# EAGLE design stm32f4stampV1_3_1 (EAGLE 9.6.1)
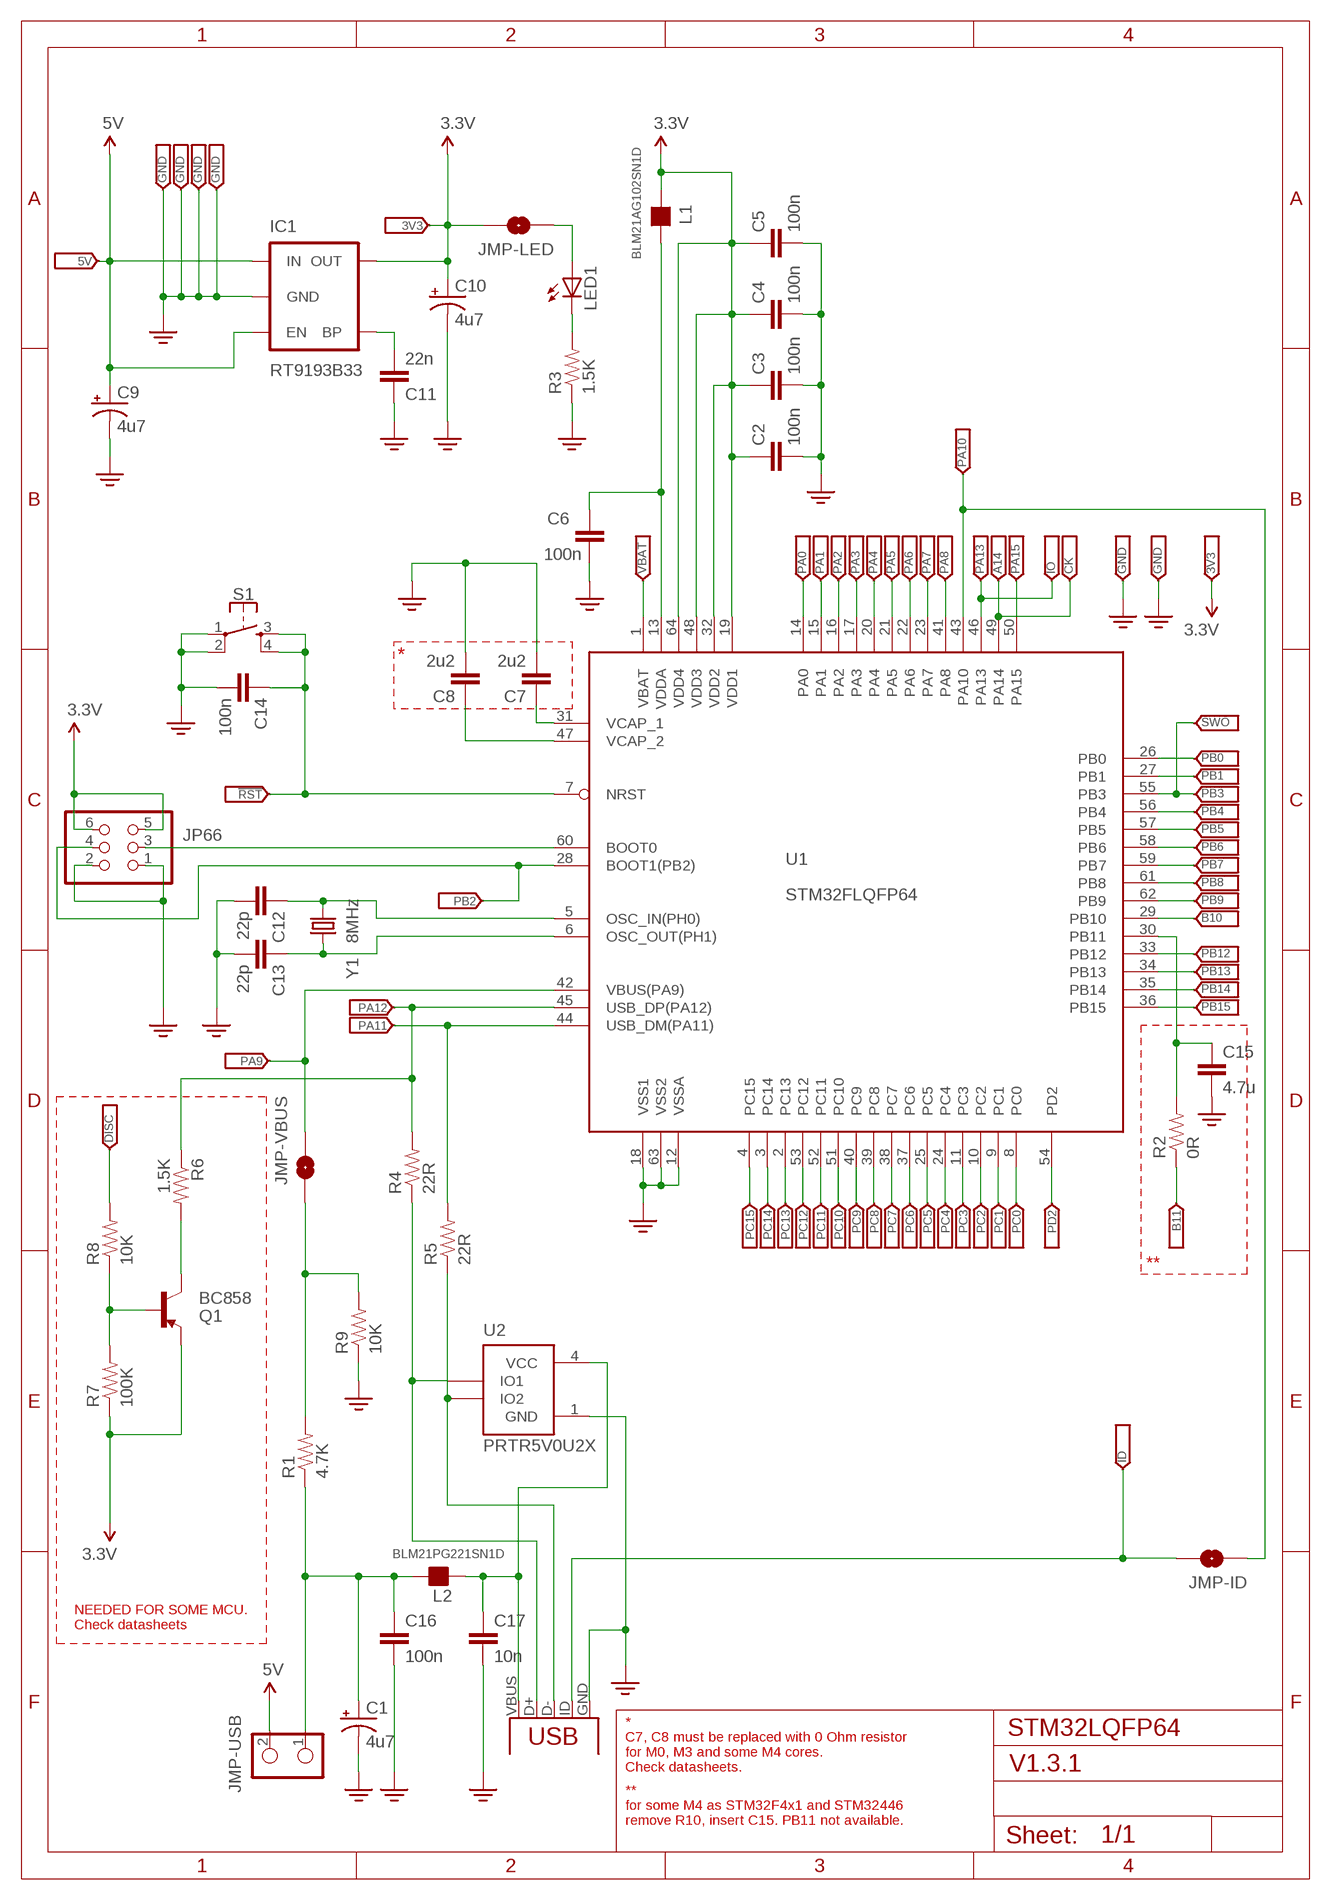
[diagram p0: schematic, sheet 1]

## Parts
C1  4u7  CAP_POL1206-KIT  [EIA3216-KIT]
C2  100n  CAP0805  [0805]
C3  100n  CAP0805  [0805]
C4  100n  CAP0805  [0805]
C5  100n  CAP0805  [0805]
C6  100n  CAP0805  [0805]
C7  2u2  CAP0805  [0805]
C8  2u2  CAP0805  [0805]
C9  4u7  CAP_POL1206-KIT  [EIA3216-KIT]
C10  4u7  CAP_POL1206-KIT  [EIA3216-KIT]
C11  22n  CAP0805  [0805]
C12  22p  CAP0805  [0805]
C13  22p  CAP0805  [0805]
C14  100n  CAP0805  [0805]
C15  4.7u  CAP0805  [0805]
C16  100n  CAP0805  [0805]
C17  10n  CAP0805  [0805]
IC1  RT9193B33  V_REG_LDOSMD  [SOT23-5]
JMP-ID  SOLDERJUMPERNO  [SJ_2S-NO]
JMP-LED  SOLDERJUMPERNO  [SJ_2S-NO]
JMP-USB  JUMPER-2PTH  [1X02]
JMP-VBUS  SOLDERJUMPERNO  [SJ_2S-NO]
JP1  PA12  HEADERHOLE-HEADERHOLE  [1X1-HEADER-HOLE]
JP2  5V  HEADERHOLE-HEADERHOLE  [1X1-HEADER-HOLE]
JP3  GND  HEADERHOLE-HEADERHOLE  [1X1-HEADER-HOLE]
JP4  3V3  HEADERHOLE-HEADERHOLE  [1X1-HEADER-HOLE]
JP5  DISC  HEADERHOLE-HEADERHOLE  [1X1-HEADER-HOLE]
JP6  GND  HEADERHOLE-HEADERHOLE  [1X1-HEADER-HOLE]
JP7  GND  HEADERHOLE-HEADERHOLE  [1X1-HEADER-HOLE]
JP8  PB8  HEADERHOLE-HEADERHOLE  [1X1-HEADER-HOLE]
JP9  PA10  HEADERHOLE-HEADERHOLE  [1X1-HEADER-HOLE]
JP10  PA8  HEADERHOLE-HEADERHOLE  [1X1-HEADER-HOLE]
JP11  PA13  HEADERHOLE-HEADERHOLE  [1X1-HEADER-HOLE]
JP12  PC9  HEADERHOLE-HEADERHOLE  [1X1-HEADER-HOLE]
JP13  PC15  HEADERHOLE-HEADERHOLE  [1X1-HEADER-HOLE]
JP14  PC14  HEADERHOLE-HEADERHOLE  [1X1-HEADER-HOLE]
JP15  PC13  HEADERHOLE-HEADERHOLE  [1X1-HEADER-HOLE]
JP16  PC12  HEADERHOLE-HEADERHOLE  [1X1-HEADER-HOLE]
JP17  PC11  HEADERHOLE-HEADERHOLE  [1X1-HEADER-HOLE]
JP18  PC10  HEADERHOLE-HEADERHOLE  [1X1-HEADER-HOLE]
JP19  PC8  HEADERHOLE-HEADERHOLE  [1X1-HEADER-HOLE]
JP20  PC7  HEADERHOLE-HEADERHOLE  [1X1-HEADER-HOLE]
JP21  PC6  HEADERHOLE-HEADERHOLE  [1X1-HEADER-HOLE]
JP22  PC5  HEADERHOLE-HEADERHOLE  [1X1-HEADER-HOLE]
JP23  PC4  HEADERHOLE-HEADERHOLE  [1X1-HEADER-HOLE]
JP24  PC3  HEADERHOLE-HEADERHOLE  [1X1-HEADER-HOLE]
JP25  PC2  HEADERHOLE-HEADERHOLE  [1X1-HEADER-HOLE]
JP26  PC1  HEADERHOLE-HEADERHOLE  [1X1-HEADER-HOLE]
JP27  PC0  HEADERHOLE-HEADERHOLE  [1X1-HEADER-HOLE]
JP28  PD2  HEADERHOLE-HEADERHOLE  [1X1-HEADER-HOLE]
JP29  PA0  HEADERHOLE-HEADERHOLE  [1X1-HEADER-HOLE]
JP30  PA1  HEADERHOLE-HEADERHOLE  [1X1-HEADER-HOLE]
JP31  PA2  HEADERHOLE-HEADERHOLE  [1X1-HEADER-HOLE]
JP32  PA3  HEADERHOLE-HEADERHOLE  [1X1-HEADER-HOLE]
JP33  PA4  HEADERHOLE-HEADERHOLE  [1X1-HEADER-HOLE]
JP34  PA5  HEADERHOLE-HEADERHOLE  [1X1-HEADER-HOLE]
JP35  PA6  HEADERHOLE-HEADERHOLE  [1X1-HEADER-HOLE]
JP36  PA7  HEADERHOLE-HEADERHOLE  [1X1-HEADER-HOLE]
JP37  A14  HEADERHOLE-HEADERHOLE  [1X1-HEADER-HOLE]
JP38  PA15  HEADERHOLE-HEADERHOLE  [1X1-HEADER-HOLE]
JP39  PB0  HEADERHOLE-HEADERHOLE  [1X1-HEADER-HOLE]
JP40  PB1  HEADERHOLE-HEADERHOLE  [1X1-HEADER-HOLE]
JP41  PB3  HEADERHOLE-HEADERHOLE  [1X1-HEADER-HOLE]
JP42  PB4  HEADERHOLE-HEADERHOLE  [1X1-HEADER-HOLE]
JP43  PB5  HEADERHOLE-HEADERHOLE  [1X1-HEADER-HOLE]
JP44  PB6  HEADERHOLE-HEADERHOLE  [1X1-HEADER-HOLE]
JP45  PB7  HEADERHOLE-HEADERHOLE  [1X1-HEADER-HOLE]
JP46  PB9  HEADERHOLE-HEADERHOLE  [1X1-HEADER-HOLE]
JP47  B10  HEADERHOLE-HEADERHOLE  [1X1-HEADER-HOLE]
JP48  B11  HEADERHOLE-HEADERHOLE  [1X1-HEADER-HOLE]
JP49  PB12  HEADERHOLE-HEADERHOLE  [1X1-HEADER-HOLE]
JP50  PB13  HEADERHOLE-HEADERHOLE  [1X1-HEADER-HOLE]
JP51  PB14  HEADERHOLE-HEADERHOLE  [1X1-HEADER-HOLE]
JP52  PB15  HEADERHOLE-HEADERHOLE  [1X1-HEADER-HOLE]
JP53  VBAT  HEADERHOLE-HEADERHOLE  [1X1-HEADER-HOLE]
JP54  !RST  HEADERHOLE-HEADERHOLE  [1X1-HEADER-HOLE]
JP55  GND  HEADERHOLE-HEADERHOLE  [1X1-HEADER-HOLE]
JP56  ID  HEADERHOLE-HEADERHOLE  [1X1-HEADER-HOLE]
JP57  PB2  HEADERHOLE-HEADERHOLE  [1X1-HEADER-HOLE]
JP58  PA11  HEADERHOLE-HEADERHOLE  [1X1-HEADER-HOLE]
JP59  IO  HEADERHOLE-HEADERHOLE  [1X1-HEADER-HOLE]
JP60  CK  HEADERHOLE-HEADERHOLE  [1X1-HEADER-HOLE]
JP61  SWO  HEADERHOLE-HEADERHOLE  [1X1-HEADER-HOLE]
JP62  GND  HEADERHOLE-HEADERHOLE  [1X1-HEADER-HOLE]
JP63  3V3  HEADERHOLE-HEADERHOLE  [1X1-HEADER-HOLE]
JP64  PA9  HEADERHOLE-HEADERHOLE  [1X1-HEADER-HOLE]
JP65  GND  HEADERHOLE-HEADERHOLE  [1X1-HEADER-HOLE]
JP66  PINHD-2X3  [2X03]
L1  BLM21AG102SN1D  FB_0805  [L0805]
L2  BLM21PG221SN1D  FB_0805  [L0805]
LED1  LEDSML0805  [SML0805]
Q1  BC858  TRANSISTOR_PNPSMD  [SOT23-3]
R1  4.7K  RESISTOR0805-RES  [0805]
R2  0R  RESISTOR0805-RES  [0805]
R3  1.5K  RESISTOR0805-RES  [0805]
R4  22R  RESISTOR0805-RES  [0805]
R5  22R  RESISTOR0805-RES  [0805]
R6  1.5K  RESISTOR0805-RES  [0805]
R7  100K  RESISTOR0805-RES  [0805]
R8  10K  RESISTOR0805-RES  [0805]
R9  10K  RESISTOR0805-RES  [0805]
S1  MOMENTARY-SWITCH-SPST-2-SMD-5.2MM  [TACTILE_SWITCH_SMD_5.2MM]
U1  STM32FLQFP64  STM32F405RGT  [LQFP64]
U2  PRTR5V0U2X  [SOT-143B]
USB  USB-MICROB-SMD  [USB-MICROB-SMD]
Y1  8MHz  CRYSTAL5X3  [CRYSTAL-SMD-5X3]

## Nets
3.3V: C2.1 C3.1 C4.1 C5.1 C10.A(+) IC1.5(OUT) JMP-LED.2 JP4.1 JP63.1 JP66.5 JP66.6 L1.2 Q1.2(E) R7.1 U1.19(VDD1) U1.32(VDD2) U1.48(VDD3) U1.64(VDD4)
5V: C9.A(+) IC1.1(IN) IC1.3(EN) JMP-USB.2 JP2.1
GND: C1.C(-) C2.2 C3.2 C4.2 C5.2 C6.2 C7.2 C8.2 C9.C(-) C10.C(-) C11.1 C12.2 C13.2 C14.2 C15.2 C16.2 C17.2 IC1.2(GND) JP3.1 JP6.1 JP7.1 JP55.1 JP62.1 JP65.1 JP66.1 JP66.2 R3.1 R9.1 S1.1 S1.2 U1.12(VSSA) U1.18(VSS1) U1.63(VSS2) U2.1(GND) USB.GND USB.MT1 USB.MT2 USB.MT3 USB.MT4
N$1: JP1.1 R4.2 R6.1 U1.45(USB_DP(PA12))
N$2: JP13.1 U1.4(PC15)
N$3: C1.A(+) C16.1 JMP-USB.1 L2.2 R1.1
N$4: JP12.1 U1.40(PC9)
N$5: C17.1 L2.1 U2.4(VCC) USB.VBUS
N$6: JP58.1 R5.2 U1.44(USB_DM(PA11))
N$7: JP8.1 U1.61(PB8)
N$8: C11.2 IC1.4(BP)
N$9: JP66.3 U1.60(BOOT0)
N$10: JP10.1 U1.41(PA8)
N$11: JP11.1 JP59.1 U1.46(PA13)
N$12: C13.1 U1.6(OSC_OUT(PH1)) Y1.1
N$13: C7.1 U1.31(VCAP_1)
N$14: C8.1 U1.47(VCAP_2)
N$15: C12.1 U1.5(OSC_IN(PH0)) Y1.3
N$16: JP57.1 JP66.4 U1.28(BOOT1(PB2))
N$17: C14.1 JP54.1 S1.3 S1.4 U1.7(NRST)
N$18: LED1.C R3.2
N$19: C6.1 L1.1 U1.13(VDDA)
N$20: JMP-ID.2 JP56.1 USB.ID
N$21: R5.1 U2.3(IO2) USB.D-
N$22: JMP-ID.1 JP9.1 U1.43(PA10)
N$23: JP14.1 U1.3(PC14)
N$24: JMP-VBUS.1 R1.2 R9.2
N$25: JP15.1 U1.2(PC13)
N$26: JP16.1 U1.53(PC12)
N$27: JP17.1 U1.52(PC11)
N$28: JP18.1 U1.51(PC10)
N$29: JP19.1 U1.39(PC8)
N$30: JP20.1 U1.38(PC7)
N$31: JP21.1 U1.37(PC6)
N$32: JP22.1 U1.25(PC5)
N$33: JP23.1 U1.24(PC4)
N$34: JP24.1 U1.11(PC3)
N$35: JP25.1 U1.10(PC2)
N$36: JP26.1 U1.9(PC1)
N$37: JP27.1 U1.8(PC0)
N$38: JP28.1 U1.54(PD2)
N$39: JP29.1 U1.14(PA0)
N$40: JP30.1 U1.15(PA1)
N$41: JP31.1 U1.16(PA2)
N$42: JP32.1 U1.17(PA3)
N$43: JP33.1 U1.20(PA4)
N$44: JP34.1 U1.21(PA5)
N$45: JP35.1 U1.22(PA6)
N$46: JP36.1 U1.23(PA7)
N$47: JP37.1 JP60.1 U1.49(PA14)
N$48: JP38.1 U1.50(PA15)
N$49: JP39.1 U1.26(PB0)
N$50: JP40.1 U1.27(PB1)
N$51: JP41.1 JP61.1 U1.55(PB3)
N$52: JP42.1 U1.56(PB4)
N$53: JP43.1 U1.57(PB5)
N$54: JP44.1 U1.58(PB6)
N$55: JP45.1 U1.59(PB7)
N$56: JP46.1 U1.62(PB9)
N$57: JP47.1 U1.29(PB10)
N$58: C15.1 R2.2 U1.30(PB11)
N$59: JP49.1 U1.33(PB12)
N$60: JP50.1 U1.34(PB13)
N$61: JP51.1 U1.35(PB14)
N$62: JP52.1 U1.36(PB15)
N$63: JP53.1 U1.1(VBAT)
N$65: R4.1 U2.2(IO1) USB.D+
N$66: JMP-LED.1 LED1.A
N$67: JMP-VBUS.2 JP64.1 U1.42(VBUS(PA9))
N$68: Q1.3(C) R6.2
N$70: JP48.1 R2.1
N$71: Q1.1(B) R7.2 R8.1
N$72: JP5.1 R8.2

## Notes on the sheet
- *
- **
- NEEDED FOR SOME MCU. 
  Check datasheets
- STM32LQFP64
- *
  C7, C8 must be replaced with 0 Ohm resistor 
  for M0, M3 and some M4 cores. 
  Check datasheets.
- V1.3.1
- **
  for some M4 as STM32F4x1 and STM32446
  remove R10, insert C15. PB11 not available.

## Library data of the parts
C1 C9 C10 = stm32f4stamp:CAP_POL: Capacitor Polarized These are standard SMD and PTH capacitors. Normally 10uF, 47uF, and 100uF in electrolytic and tantalum varieties. Always verify the external diameter of the through hole cap, it varies with capacity, voltage, and manufacturer. The EIA devices should be standard.
C2-C8 C11-C17 = stm32f4stamp:CAP: Capacitor Standard 0603 ceramic capacitor, and 0.1" leaded capacitor.
IC1 = stm32f4stamp:V_REG_LDO: Voltage Regulator LDO Standard 150mA LDO voltage regulator in SOT-23 layout. Micrel part MIC5205. BP (by-pass) pin is used to lower output noise with 470pF cap.
JMP-ID JMP-LED JMP-VBUS = stm32f4stamp:SOLDERJUMPER: Solder Jumper Standard SMD solder jumper. Used to automate production. Two varients : Normally Open and Normally Closed are the same, but have different paste layers. NC will have a large amount of paste and should jumper during reflow.
JMP-USB = stm32f4stamp:JUMPER-2: Jumper Basic 0.1" spaced jumper. Use with breakaway headers.
JP1-JP65 = stm32f4stamp:HEADERHOLE
JP66 = pinhead:PINHD-2X3: PIN HEADER
L1 L2 = rc-master:FB_: FERRITE BEAD
LED1 = led:LED: LED OSRAM: - CHIPLED LG R971, LG N971, LY N971, LG Q971, LY Q971, LO R971, LY R971 LH N974, LH R974 LS Q976, LO Q976, LY Q976 LO Q996 - Hyper CHIPLED LW Q18S LB Q993, LB Q99A, LB R99A - SideLED LS A670, LO A670, LY A670, LG A670, LP A670 LB A673, LV A673, LT A673, LW A673 LH A674 LY A675 LS A676, LA A676, LO A676, LY A676, LW A676 LS A679, LY A679, LG A679 - Hyper Micro SIDELED® LS Y876, LA Y876, LO Y876, LY Y876 LT Y87S - SmartLED LW L88C, LW L88S LB L89C, LB L89S, LG L890 LS L89K, LO L89K, LY L89K LS L896, LA L896, LO L896, LY L896 - TOPLED LS T670, LO T670, LY T670, LG T670, LP T670 LSG T670, LSP T670, LSY T670, LOP T670, LYG T670 LG T671, LOG T671, LSG T671 LB T673, LV T673, LT T673, LW T673 LH T674 LS T676, LA T676, LO T676, LY T676, LB T676, LH T676, LSB T676, LW T676 LB T67C, LV T67C, LT T67C, LS T67K, LO T67K, LY T67K, LW E67C LS E67B, LA E67B, LO E67B, LY E67B, LB E67C, LV E67C, LT E67C LW T67C LS T679, LY T679, LG T679 LS T770, LO T770, LY T770, LG T770, LP T770 LB T773, LV T773, LT T773, LW T773 LH T774 LS E675, LA E675, LY E675, LS T675 LS T776, LA T776, LO T776, LY T776, LB T776 LHGB T686 LT T68C, LB T68C - Hyper Mini TOPLED® LB M676 - Mini TOPLED Santana® LG M470 LS M47K, LO M47K, LY M47K Source: http://www.osram.convergy.de LUXEON: - LUMILED® LXK2-PW12-R00, LXK2-PW12-S00, LXK2-PW14-U00, LXK2-PW14-V00 LXK2-PM12-R00, LXK2-PM12-S00, LXK2-PM14-U00 LXK2-PE12-Q00, LXK2-PE12-R00, LXK2-PE12-S00, LXK2-PE14-T00, LXK2-PE14-U00 LXK2-PB12-K00, LXK2-PB12-L00, LXK2-PB12-M00, LXK2-PB14-N00, LXK2-PB14-P00, LXK2-PB14-Q00 LXK2-PR12-L00, LXK2-PR12-M00, LXK2-PR14-Q00, LXK2-PR14-R00 LXK2-PD12-Q00, LXK2-PD12-R00, LXK2-PD12-S00 LXK2-PH12-R00, LXK2-PH12-S00 LXK2-PL12-P00, LXK2-PL12-Q00, LXK2-PL12-R00 Source: www.luxeon.com KINGBRIGHT: KA-3528ASYC Source: www.kingbright.com
Q1 = SparkFun:TRANSISTOR_PNP
R1-R9 = stm32f4stamp:RESISTOR: Resistor Basic schematic elements and footprints for 0603, 1206, and PTH resistors.
S1 = SparkFun-Switches:MOMENTARY-SWITCH-SPST-2: Momentary Switch (Pushbutton) - SPST - Two Circuits Normally-open (NO) SPST momentary switches (buttons, pushbuttons). Schematic symbol includes two switch circuits. Variants SMD-4.6MMX2.8MM - 4.60mm x 2.80mm Tactile Momentary Button Switch - Used on SparkFun SAMD21 Mini Breakout <https://www.sparkfun.com/products/13664> SMD-5.2MM - Mini Pushbutton Switch - SMD <https://www.sparkfun.com/products/8720> - Used on Arduino Pro Mini <https://www.sparkfun.com/products/11114>; PROD_ID: SWCH-08247; SF_SKU: COM-08720
U1 = stm32f4stamp:STM32F405RGT
U2 = Volks73-NXPSemiconductors:PRTR5V0U2X?: I2C-Bus EDS Protection Ulta low capacitance double rail-to-rail ESD protection diode Documentation Datasheet <http://www.nxp.com/documents/data_sheet/PRTR5V0U2X.pdf> General Description Ultra low capacitance rail-to-rail ElectroStatic Discharge (ESD) protection diode in a small SOT143B Surface-Mounted Device (SMD) plastic package designed to protect two Hi-Speed data lines or high-frequency signal lines from the damage caused by ESD and other transients. PRTR5V0U2X incorporates two pairs of ultra low capacitance rail-to-rail diodes as well as an additional ESD protection diode to ensure signal line protection even if no supply voltage is available. Features ESD protection of two Hi-Speed data lines or high-frequency signal lines Ultra low input/output to ground capacitance: C(I/O-GND) = 1 pF ESD protection up to 8kV IEC 61000-4-2, level 4 (ESD) Very low clamping voltage due to an integrated additional ESD protection diode Very low reverse current Small SMD plastic package Applications USB 2.0 ports Digital Video Interface (DVI)/High Definition Multimedia Interface (HDMI) interfaces Mobile and cordless phones Personal Digital Assistants (PDA) Digital Cameras Wide Area Network (WAN) / Local Area Network (LAN) systems PCs, notebooks, printers, and other PC peripherals; APPLICATIONS: General Purpose; BIDIRECTIONAL_CHANNELS: 2; CAPACITANCE: 1pF @ 1MHz; CURRENT_PEAK_PULSE: -; DESCRIPTION: TVS DIODE 5.5VWM SOT143B; DOCUMENTATION_LINK: <a href="http://www.nxp.com/documents/data_sheet/PRTR5V0U2X.pdf">Datasheet</a>; DOCUMENTATION_URL: http://www.nxp.com/documents/data_sheet/PRTR5V0U2X.pdf; MANUFACTURER: NXP Semiconductors; MOUNTING_TYPE: Surface Mount; OPERATING_TEMPERATURE: -40C ~ 85C; PART_NUMBER: PRTR5V0U2X,215; POWER-PEAK_PULSE: -; POWER_LINE_PROTECTION: Yes; SUPPLIER_ITEM_LINK: <a href="http://www.digikey.com/product-detail/en/PRTR5V0U2X,215/568-4140-1-ND/1589981">Details</a>; SUPPLIER_ITEM_NUMBER: 568-4140-1-ND; SUPPLIER_ITEM_URL: http://www.digikey.com/product-detail/en/PRTR5V0U2X,215/568-4140-1-ND/1589981; SUPPLIER_LINK: <a href="http://www.digikey.com">Home Page</a>; SUPPLIER_NAME: Digi-Key; SUPPLIER_URL: http://www.digikey.com; TYPE: Steering (Rail to Rail); UNIDIRECTIONAL_CHANNELS: -; VOLTAGE_BREAKDOWN: 6V; VOLTAGE_CLAMPING: -; VOLTAGE_REVERSE: 5.5V
USB = stm32f4stamp:USB: USB Connectors USB-B-PTH is fully proven SKU : PRT-00139 USB-miniB is fully proven SKU : PRT-00587 USB-A-PCB is untested. USB-A-H is throughly reviewed, but untested. Spark Fun Electronics SKU : PRT-00437 USB-B-SMT is throughly reviewed, but untested. Needs silkscreen touching up. USB-A-S has not been used/tested USB-MB-H has not been used/tested
Y1 = stm32f4stamp:CRYSTAL: Crystals Various standard crystals. Proven footprints. Spark Fun Electronics SKU : COM-00534

## Board
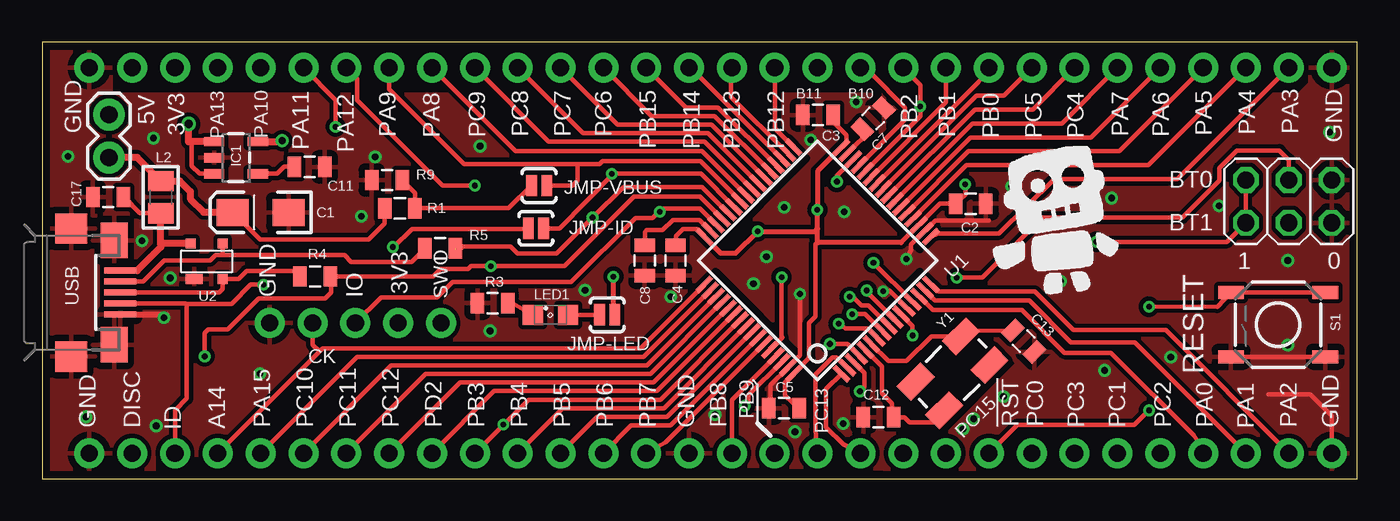
[diagram p1: board, top side]
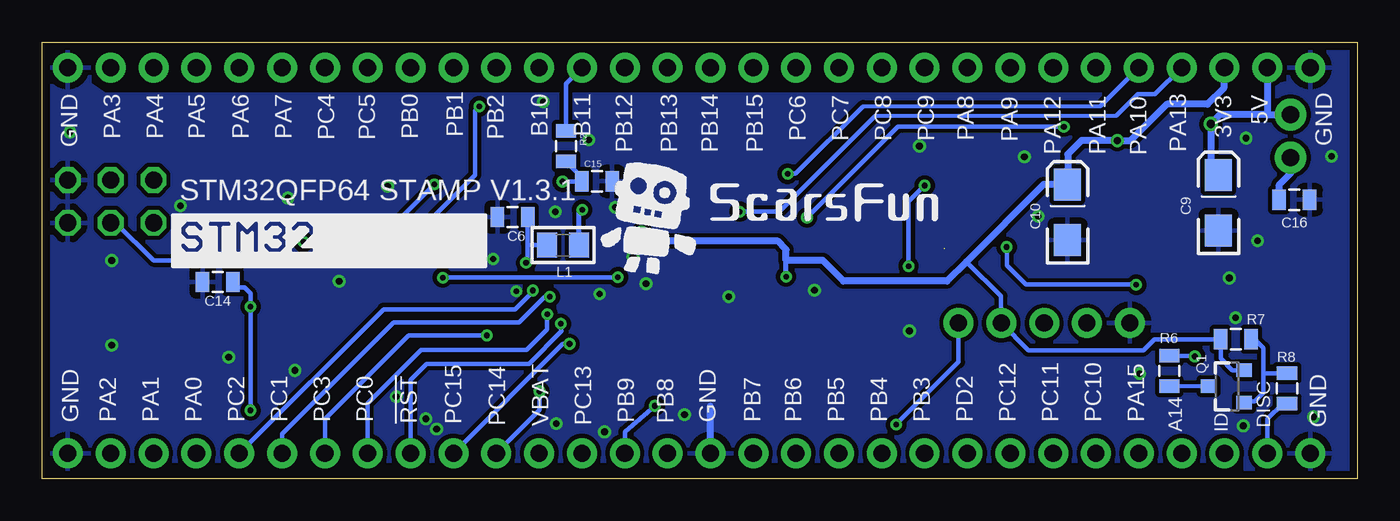
[diagram p2: board, bottom side, seen from below]

Size 77.98 x 25.91 mm. Coordinates in mm from the lower left corner, seen from the top.
Outline: 0,0 77.98,0 77.98,25.91 0,25.91 0,0
Copper layers (1*16): Top 0.0356mm / dielectric 1.9011mm / Bottom 0.0356mm
Design rules "default *": minimum track width 6mil, minimum drill 13mil, track to track 10mil, track to pad 15mil, pad to pad 6mil, via to via 6mil, smd to smd 6mil, copper to edge 18mil, drill to drill 6mil, minimum pad ring 7mil, minimum via ring 7mil, stop-mask expansion 2mil, vias tented up to drill 25mil, thermal gap 15mil
tRestrict: 2 lines

### Footprints (pad centres in the part's own frame; a part is rotated, then mirrored left to right if it is on the bottom)
EIA3216-KIT = smd 1.9 x 1.6: A 1.65,0; C -1.65,0
0805 = smd 0.8 x 1.2: 1 -0.9,0; 2 0.9,0
SOT23-5 = smd 0.55 x 1.2: 1 -0.95,-1.3; 2 0,-1.3; 3 0.95,-1.3; 4 0.95,1.3; 5 -0.95,1.3
SJ_2S-NO = smd 0.635 x 1.27: 1 -0.45,0; 2 0.45,0
1X02 = drill 1.016 pad 1.88: 1 0,0; 2 2.54,0
1X1-HEADER-HOLE = drill 1.016 pad 1.778: 1 0,0
2X03 = drill 1.016 octagon: 1 -2.54,-1.27; 2 -2.54,1.27; 3 0,-1.27; 4 0,1.27; 5 2.54,-1.27; 6 2.54,1.27
L0805 = smd 1.2 x 1.5: 1 -0.953,0; 2 0.953,0
SML0805 = smd 1.2 x 1.2: A 1.05,0; C -1.05,0
SOT23-3 = smd 0.8 x 0.9: 1 -0.95,-1; 2 0.95,-1; 3 0,1.1
TACTILE_SWITCH_SMD_5.2MM = smd 1.524 x 0.762: 1 -2.794,1.905; 2 2.794,1.905; 3 -2.794,-1.905; 4 2.794,-1.905
LQFP64 = smd 0.3 x 1.2: 1 -3.75,-5.75; 2 -3.25,-5.75; 3 -2.75,-5.75; 4 -2.25,-5.75; 5 -1.75,-5.75; 6 -1.25,-5.75; 7 -0.75,-5.75; 8 -0.25,-5.75; 9 0.25,-5.75; 10 0.75,-5.75; 11 1.25,-5.75; 12 1.75,-5.75; 13 2.25,-5.75; 14 2.75,-5.75; 15 3.25,-5.75; 16 3.75,-5.75; 33 3.75,5.75; 34 3.25,5.75; 35 2.75,5.75; 36 2.25,5.75; 37 1.75,5.75; 38 1.25,5.75; 39 0.75,5.75; 40 0.25,5.75; 41 -0.25,5.75; 42 -0.75,5.75; 43 -1.25,5.75; 44 -1.75,5.75; 45 -2.25,5.75; 46 -2.75,5.75; 47 -3.25,5.75; 48 -3.75,5.75 | smd 1.2 x 0.3: 17 5.75,-3.75; 18 5.75,-3.25; 19 5.75,-2.75; 20 5.75,-2.25; 21 5.75,-1.75; 22 5.75,-1.25; 23 5.75,-0.75; 24 5.75,-0.25; 25 5.75,0.25; 26 5.75,0.75; 27 5.75,1.25; 28 5.75,1.75; 29 5.75,2.25; 30 5.75,2.75; 31 5.75,3.25; 32 5.75,3.75; 49 -5.75,3.75; 50 -5.75,3.25; 51 -5.75,2.75; 52 -5.75,2.25; 53 -5.75,1.75; 54 -5.75,1.25; 55 -5.75,0.75; 56 -5.75,0.25; 57 -5.75,-0.25; 58 -5.75,-0.75; 59 -5.75,-1.25; 60 -5.75,-1.75; 61 -5.75,-2.25; 62 -5.75,-2.75; 63 -5.75,-3.25; 64 -5.75,-3.75
SOT-143B = smd 1 x 0.6: 1 -0.75,-1.05 | smd 0.6 x 0.6: 2 0.95,-1.05; 3 0.95,1.05; 4 -0.95,1.05
USB-MICROB-SMD = smd 0.35 x 1.9: D+ 0,2.9; D- -0.65,2.9; GND 1.3,2.9; ID 0.65,2.9; VBUS -1.3,2.9 | smd 1.8 x 1.9: MT1 -3.8,0; MT2 3.8,0 | smd 2.1 x 1.6: MT3 -3.1,2.55; MT4 3.1,2.55
CRYSTAL-SMD-5X3 = smd 2 x 1.2: 1 -1.9,-1.2; 2 1.9,-1.2; 3 1.9,1.2; 4 -1.9,1.2

### Placement (x,y rotation side)
C1  12.95,15.81 180 top
C2  55.05,16.32 0 top
C3  46,21.59 180 top
C4  37.55,12.95 270 top
C5  43.98,4.19 180 top
C6  50.09,15.53 180 bottom
C7  49.26,21.37 45 top
C8  35.73,12.95 270 top
C9  8.23,16.37 90 bottom
C10  17.18,15.81 90 bottom
C11  15.86,18.5 180 top
C12  49.58,3.66 180 top
C13  58.19,8.17 315 top
C14  67.56,11.68 180 bottom
C15  45.08,17.65 0 bottom
C16  3.73,16.56 0 bottom
C17  3.91,16.71 180 top
IC1  11.49,19.05 270 top
JMP-ID  29.27,14.86 180 top
JMP-LED  33.5,9.73 0 top
JMP-USB  3.96,19.06 90 top
JMP-VBUS  29.46,17.4 0 top
JP1  18.03,24.38 0 top
JP2  5.33,24.38 0 top
JP3  2.79,24.38 0 top
JP4  7.87,24.38 0 top
JP5  5.33,1.52 0 top
JP6  76.45,1.52 0 top
JP7  76.45,24.38 0 top
JP8  40.89,1.52 0 top
JP9  12.95,24.38 0 top
JP10  23.11,24.38 90 top
JP11  10.41,24.38 0 top
JP12  25.65,24.38 0 top
JP13  53.59,1.52 0 top
JP14  51.05,1.52 0 top
JP15  45.97,1.52 0 top
JP16  20.57,1.52 0 top
JP17  18.03,1.52 0 top
JP18  15.49,1.52 0 top
JP19  28.19,24.38 0 top
JP20  30.73,24.38 0 top
JP21  33.27,24.38 0 top
JP22  58.67,24.38 0 top
JP23  61.21,24.38 0 top
JP24  61.21,1.52 0 top
JP25  66.29,1.52 0 top
JP26  63.75,1.52 0 top
JP27  58.67,1.52 0 top
JP28  23.11,1.52 0 top
JP29  68.83,1.52 0 top
JP30  71.37,1.52 0 top
JP31  73.91,1.52 0 top
JP32  73.91,24.38 0 top
JP33  71.37,24.38 0 top
JP34  68.83,24.38 0 top
JP35  66.29,24.38 0 top
JP36  63.75,24.38 0 top
JP37  10.41,1.52 0 top
JP38  12.95,1.52 0 top
JP39  56.13,24.38 0 top
JP40  53.59,24.38 0 top
JP41  25.65,1.52 0 top
JP42  28.19,1.52 0 top
JP43  30.73,1.52 0 top
JP44  33.27,1.52 0 top
JP45  35.81,1.52 0 top
JP46  43.43,1.52 270 top
JP47  48.51,24.38 270 top
JP48  45.97,24.38 270 top
JP49  43.43,24.38 270 top
JP50  40.89,24.38 270 top
JP51  38.35,24.38 270 top
JP52  35.81,24.38 270 top
JP53  48.51,1.52 0 top
JP54  56.13,1.52 0 top
JP55  38.35,1.52 0 top
JP56  7.87,1.52 0 top
JP57  51.05,24.38 0 top
JP58  15.49,24.38 0 top
JP59  18.57,9.25 0 top
JP60  16.03,9.25 0 top
JP61  23.65,9.25 0 top
JP62  13.49,9.25 0 top
JP63  21.11,9.25 0 top
JP64  20.57,24.38 0 top
JP65  2.79,1.52 0 top
JP66  73.91,16.46 180 top
L1  47.09,13.87 0 bottom
L2  7.04,16.71 90 top
LED1  30.14,9.73 0 top
Q1  7.72,5.49 90 bottom
R1  21.21,16.05 0 top
R2  46.91,19.74 270 bottom
R3  26.71,10.43 0 top
R4  16.19,12 0 top
R5  23.6,13.68 0 top
R6  11.15,6.4 270 bottom
R7  7.21,8.28 0 bottom
R8  4.17,5.36 270 bottom
R9  20.45,17.73 0 top
S1  73.28,9.14 180 top
U1  45.97,12.95 45 top
U2  9.75,12.9 0 top
USB  1.71,11.05 270 top
Y1  53.98,6.26 225 top

### Tracks (layer width: path | path; a pad name or v marks a point on that pad's centre or on a via)
3.3V  (via drill 0.33, 0.4)
  Top 0.152: JMP-LED.2 33.95,9.7 33.87,9.61
  Top 0.254: v54.74,17.46 54.74,16.85 C2.1 53.23,16.32 U1.19 52.01,15.1 | C5.1 44.03,4.96 44.03,5.71 U1.64 45.47,7.17 45.47,9.25 45.85,9.63 45.85,13.94 45.97,14.07 | U1.32 47.69,19.97 47.69,20.38 46.86,21.21 C3.1 | U1.48 38.81,14.83 38,14.83 37.57,14.4 37.57,13.87 C4.1 | v62.5,14.06 70.25,14.06 JP66.6 JP66.5
  Top 0.279: 50.92,14.01 50.95,14.04 52.01,15.1
  Top 0.305: U1.32 45.97,18.26 45.97,15.98 v45.96,15.96 45.97,15.95 45.97,14.84 | 33.87,9.61 v33.87,12 | 45.97,14.84 45.97,14.07 46.02,14.01 50.92,14.01 | U1.48 39.3,14.32 40.23,13.39 41.12,13.39 v42.42,14.68 45.82,14.68 45.97,14.84
  Top 0.406: IC1.5 14.16,20 v14.22,20.07
  Bottom 0.254: v54.74,17.46 58.14,14.06 v62.5,14.06 | L1.2 46.15,13.88 | Q1.2 7.4,6.44 8.1,7.14 8.1,8.27 R7.1 12.04,8.28 12.7,7.62 19.51,7.62 JP63.1 21.13,10.85 23.19,12.88
  Bottom 0.305: v33.87,12 33.87,12.95 | v45.96,15.96 46.15,15.77 46.15,13.88
  Bottom 0.406: 14.26,20.1 v14.22,20.07 | JP4.1 7.9,24.36 7.9,23.22 8.89,22.23 11.3,22.23 13.49,20.04 14.2,20.04 v14.22,20.07 | v42.42,14.68 41.86,14.1 34.34,14.1 33.87,13.6 33.87,12.95 31.69,12.95 30.48,11.73 24.33,11.73 23.19,12.88 18.61,17.46 C10.A 17.17,17.47 17.17,19.25 16.36,20.07 v14.22,20.07
5V  (via drill 0.5)
  Top 0.203: 8.72,20 8.69,20
  Top 0.254: IC1.3 9.33,18.1 8.87,18.57 8.87,19.85 8.72,20
  Top 0.406: IC1.1 8.72,20 | 8.69,20 v8.69,21.06
  Bottom 0.305: 8.69,18.5 C9.A
  Bottom 0.406: 8.69,18.5 v8.69,21.06 8.14,21.6 5.31,21.6 | 5.31,21.6 JMP-USB.2 | JP2.1 5.33,21.63 5.31,21.6
GND  (via drill 0.33, 0.35, 0.4)
  Top 0.254: U1.12 50.23,11.18 v49.87,11.12 | 56.14,15.33 52.95,15.33 U1.18 52.31,14.7 51.51,13.89 51.51,13.54 v51.24,13.04 | 72.71,5.02 75.18,5.02 76.45,3.75 JP6.1 | S1.1 S1.2 | C5.2 43.19,4.3 43.19,5.57 U1.63 44.93,7.32 v44.93,10.97
  Top 0.305: 7.37,9.75 7.37,9.59
  Top 0.356: USB.GND 7.37,9.75
  Bottom 0.406: JP55.1 38.35,4.32
  other vias: 43.99,16.1 73.85,12.95 25.97,19.74 19.74,19.1 18.92,15.57 47.5,3.28 57.49,17.35 62.99,6.44 69.79,16.19 45.57,20.1 48.26,22.36 56.98,4.88 60.38,11.72 63.41,16.66 73.85,7.94 44.64,2.79 37.27,10.81 42.18,11.57 12.91,6.24 42.95,13.18 76.33,20.57 66.92,7.23 1.52,19.13 39.89,3.81 55.23,3.56 47.55,15.85 54.6,2.95 2.59,3.67 6.76,3.14 26.56,8.78 32.19,11.19 7.59,11.91 5.92,14.12 7.22,9.56 6.6,20.22
  pour Bottom (isolate 0.254): 0.57,25.65 4.06,25.65 4.06,23.51 7.26,22.8 74.23,22.8 75.18,23.43 75.18,25.65 78.23,25.65 78.23,0.25 75.18,0.25 75.18,1.89 74.55,1.08 7.24,1.08 6.6,1.51 6.6,0.25 0.57,0.25
  pour Top (isolate 0.254): 0.57,25.65 4.06,25.65 4.06,22.8 74.55,22.8 75.18,23.43 75.18,25.65 77.95,25.45 77.95,0.05 75.23,0.1 6.6,1.46 6.6,0.25 0.57,0.25
N$1  (via drill 0.33, 0.35)
  Top 0.254: JP1.1 18.67,23.75 18.67,22.48 23.75,17.4 v25.65,17.4 | 17.12,12 23.18,12 23.62,12.45 25.25,12.45 25.43,12.62 v26.61,12.62 30.96,12.62 35.08,16.74 39,16.74 U1.45 | 17.12,12 R4.2 | 17.12,12 17.12,11.05 16.76,10.69 12.83,10.69 11,8.87 9.83,8.87 9.63,8.66 v9.63,7.26
  Bottom 0.254: v25.65,17.4 26.61,16.45 v26.61,12.62 | R6.1 9.7,7.29 v9.63,7.26
N$2  (via drill 0.35)
  Top 0.254: U1.4 47.75,8 v46.71,8
  Bottom 0.254: v46.71,8 47.12,8 JP13.1
N$3
  Top 0.152: C1.A 11.41,15.81 11.47,15.77
  Top 0.254: C1.A | 11.47,15.77 11.37,15.88 | R1.1 20.31,15.15 19.36,14.2 12.92,14.2 11.29,15.82
  Top 0.305: 6.59,17.65 L2.2
  Top 0.406: 7.54,17.65 6.59,17.65 | JMP-USB.1 5.64,19.06 L2.2 8.17,17.67 8.79,17.04 8.79,16.61 9.58,15.82 11.29,15.82 C1.A
  Bottom 0.406: JMP-USB.1 3.96,18.11 4.65,17.42 4.65,16.58 C16.1
N$4
  Top 0.254: U1.40 39.28,20 30.04,20 JP12.1
N$5
  Top 0.254: C17.1 4.85,16.71 5.79,15.77 6.72,15.77 L2.1
  Top 0.305: USB.VBUS 5.64,12.35
  Top 0.406: 5.64,12.35 7.04,13.74 7.04,13.86 | 7.04,13.86 L2.1 | U2.4 7.13,13.95 7.04,13.86
N$6  (via drill 0.33)  (1 unrouted)
  Top 0.254: U1.44 39.13,17.32 35.42,17.32 34.45,17.32 v32.63,15.5 30.49,13.36 28.19,13.36 27.78,13.78 24.87,13.78 24.5,13.63 | JP58.1 17.4,22.48 v17.4,20.89
  Top 0.406: 24.77,13.68 R5.2
  Bottom 0.254: v17.4,20.89 27.24,20.89 v32.63,15.5
N$7
  Top 0.254: U1.61 40.89,4.69 JP8.1
N$8
  Top 0.254: IC1.4 13.93,18.1 14.35,18.52 14.95,18.52 C11.2
N$9  (via drill 0.33)
  Top 0.254: v54.23,11.94 55.75,11.94 59.31,15.49 67.59,15.49 69.8,17.7 69.8,18.44 70.84,19.48 73.36,19.48 73.91,18.92 JP66.3 | U1.60 43.16,7.65 43.89,8.38 43.84,8.38 v43.84,11.96
  Bottom 0.254: v43.84,11.96 43.87,11.94 v54.23,11.94
N$10
  Top 0.254: U1.41 39.12,19.46 28.07,19.43 JP10.1
N$11  (via drill 0.33)
  Top 0.254: JP59.1 20.09,10.77 23.42,10.77 24.32,11.68 31.37,11.68 35.17,15.48 36.2,15.48 v36.61,15.85 36.79,16.03 39.01,16.03 U1.46
  Bottom 0.254: JP11.1 12.01,22.81 13.01,22.81 14.28,21.54 28.6,21.51 34.27,15.85 v36.61,15.85
N$12
  Top 0.254: U1.6 49.18,7.97 50.16,6.98 51.26,6.98 52.73,8.46 54.67,8.46 Y1.1 55.11,8.78 C13.1
N$13
  Top 0.254: U1.31 48.32,19.9 48.63,20.18 48.64,20.57 C7.1
N$14
  Top 0.254: U1.47 38.96,15.37 37.39,15.37 36.78,14.76 35.84,14.76 35.74,14.66 35.74,13.94 35.77,13.9 | 35.77,13.9 35.97,14.1 | 35.77,13.9 C8.1
N$15
  Top 0.254: U1.5 49.78,6.68 49.78,5.08 50.39,4.47 50.37,3.72 C12.1 51.13,3.66 51.43,3.35 53.07,3.35 Y1.3
N$16  (via drill 0.33)
  Top 0.254: JP57.1 52.07,23.37 v52.07,22.1 52.07,21.51 48.86,18.31 U1.28
  Bottom 0.254: JP66.4 73.61,15.19 71.37,12.95 57.4,12.95 52.32,18.03 52.32,21.84 v52.07,22.1
N$17  (via drill 0.33)
  Top 0.254: U1.7 48.95,8.91 47.62,8.91 47.27,9.2 v47.22,9.2 | JP54.1 57.81,3.2 64.75,3.2 v65.62,4.06 | 65.58,10.21 v65.62,10.21 69.66,10.2 S1.4 S1.3
  Bottom 0.254: JP54.1 56.15,5.88 55.19,6.83 49.12,6.83 47.19,8.76 47.22,8.79 v47.22,9.2 | v65.62,4.06 v65.62,10.21 65.62,11.01 65.98,11.37 66.35,11.37 C14.1
N$18
  Top 0.254: R3.2 27.93,10.41 LED1.C
N$19  (via drill 0.33)
  Top 0.254: v49.29,12.81 U1.13 | 51.65,10.48 U1.13 | U1.13 51.63,10.47
  Bottom 0.254: 48.51,13.86 L1.1 49.18,13.87 49.19,13.88 | 49.19,13.88 C6.1 | 49.19,13.88 49.19,12.91 v49.29,12.81
N$20  (via drill 0.33)
  Top 0.254: 8.53,10.39 8.57,10.35 8.57,4.76 7.87,4.06 JP56.1 | USB.ID 4.63,10.41 8.51,10.41 8.53,10.39 | v13.11,11.52 12.47,11.53 12.37,11.53 11.23,10.39 8.53,10.39 | JMP-ID.2 28.8,14.83 21.92,14.83 20.84,13.75 v20.79,13.75
  Bottom 0.254: v20.79,13.75 20.78,12.65 19.66,11.53 v13.11,11.52
N$21
  Top 0.254: 22.43,13.26 R5.1 21.9,12.88 18.31,12.88 17.92,13.27 10.73,13.27 | USB.D- 5.98,11.7 7.24,12.95 9.96,12.95 10.27,13.27 10.73,13.27 | U2.3 10.7,13.3 10.73,13.27
N$22  (via drill 0.33)
  Top 0.254: U1.43 39.06,18.1 v33.78,18.1 33.86,18.1 30.66,14.86 JMP-ID.1
  Bottom 0.254: v33.78,18.1 33.3,18.1 29.31,22.09 15.23,22.11 JP9.1
N$23  (via drill 0.35)
  Top 0.254: U1.3 48.77,6.27 48.77,5.46 v48.49,5.18
  Bottom 0.254: v48.49,5.18 48.49,4.09 JP14.1
N$24
  Top 0.254: JMP-VBUS.1 27.67,16.05 R1.2 22.11,16.97 R9.2
N$25
  Top 0.254: U1.2 47.09,7.21 46.86,7.21 45.85,6.2 45.85,2.92 JP15.1
N$26
  Top 0.254: U1.53 36.26,5.71 24.77,5.71 JP16.1
N$27
  Top 0.254: U1.52 36.06,6.22 22.73,6.22 JP17.1
N$28
  Top 0.254: U1.51 35.86,6.73 20.7,6.73 JP18.1
N$29
  Top 0.254: U1.39 39.48,20.51 32.07,20.51 JP19.1
N$30
  Top 0.254: U1.38 39.68,21.02 34.1,21.02 JP20.1
N$31
  Top 0.254: U1.37 39.88,21.53 36.13,21.53 JP21.1
N$32
  Top 0.254: U1.25 55.4,22.73 57.02,22.73 JP22.1
N$33
  Top 0.254: U1.24 55.28,21.88 55.31,21.91 58.74,21.91 JP23.1
N$34  (via drill 0.33)
  Top 0.254: U1.11 51.61,9.08 v51.61,8.51
  Bottom 0.254: v51.61,8.51 56.26,8.51 61.21,3.56 JP24.1
N$35  (via drill 0.33)
  Top 0.254: U1.10 48.89,11.09 v48.89,11.18
  Bottom 0.254: JP25.1 57.73,10.06 57.72,10.05 49.94,10.05 48.89,11.09 v48.89,11.18
N$36  (via drill 0.33)
  Top 0.254: U1.9 48.99,10.29 48.58,10.29 48.07,10.79 v47.88,10.79
  Bottom 0.254: v47.88,10.79 48.2,10.79 49.71,9.28 57.14,9.28 63.75,2.67 JP26.1
N$37  (via drill 0.33)
  Top 0.254: U1.8 48.79,9.78 v48.03,9.78
  Bottom 0.254: JP27.1 58.67,4.47 55.5,7.64 49.25,7.64 48.03,8.87 v48.03,9.78
N$38
  Top 0.254: U1.54 36.46,5.21 26.8,5.21 JP28.1
N$39
  Top 0.254: U1.14 52.8,10.01 58.09,10.01 60.62,7.48 63.38,7.48 68.27,2.58 68.6,2.1 JP29.1
N$40
  Top 0.254: U1.15 | JP30.1 64.8,8.1 61,8.1 58.52,10.58 52.95,10.58 U1.15
N$41
  Top 0.254: U1.16 53.14,11.11 58.85,11.11 61.14,8.83 66.64,8.83 JP31.1
N$42
  Top 0.254: U1.17 53.08,14.57 56.73,14.57 60.01,17.78 67.31,17.78 JP32.1
N$43
  Top 0.254: U1.20 54.81,18.61 65.59,18.61 JP33.1
N$44
  Top 0.254: U1.21 54.93,19.43 63.88,19.43 JP34.1
N$45
  Top 0.254: U1.22 55.04,20.26 62.17,20.26 JP35.1
N$46
  Top 0.254: U1.23 55.16,21.08 60.45,21.08 JP36.1
N$47
  Top 0.254: U1.49 35.46,7.75 16.64,7.75 16.44,7.55 | 16.44,7.55 JP37.1 | JP60.1 16.03,7.95 16.44,7.55
N$48
  Top 0.254: U1.50 35.66,7.24 18.67,7.24 JP38.1
N$49
  Top 0.254: U1.26 55.5,23.54 JP39.1
N$50
  Top 0.254: U1.27 53.59,22.34 JP40.1
N$51  (via drill 0.33)
  Top 0.254: U1.55 36.66,4.7 28.83,4.7 v27.34,3.21 JP41.1
  Bottom 0.254: v27.34,3.21 27.24,3.34 23.65,6.93 JP61.1
N$52
  Top 0.254: U1.56 36.86,4.19 30.86,4.19 JP42.1
N$53
  Top 0.254: U1.57 37.06,3.68 32.89,3.68 JP43.1
N$54
  Top 0.254: U1.58 37.26,3.17 34.92,3.17 JP44.1
N$55
  Top 0.254: U1.59 36.95,2.16 JP45.1
N$56  (via drill 0.33)
  Top 0.254: U1.62 41.88,4.98 41.88,4.56 v41.66,4.33
  Bottom 0.254: JP46.1 43.43,2.79 v41.66,4.33
N$57
  Top 0.152: U1.29 48.46,18.61 48.59,18.75
  Top 0.254: U1.29 48.59,18.75 51.17,21.32 51.17,22.02 49.15,24.07
  Top 0.305: 49.15,24.07 48.83,24.07 JP47.1
N$58  (via drill 0.35)
  Top 0.254: U1.30 47.12,17.99 v47.12,17.63
  Bottom 0.254: v47.12,17.63 46.01,17.63 C15.1 45.98,17.91 R2.2
N$59
  Top 0.254: U1.33 43.45,20.79 43.45,24.37 JP49.1
N$60
  Top 0.254: U1.34 40.86,22.66 40.86,24.35 JP50.1
N$61
  Top 0.254: U1.35 38.8,24.03 38.71,24.03 JP51.1
N$62
  Top 0.254: U1.36 40.07,22.03 38.16,22.03 JP52.1
N$63
  Top 0.254: U1.1 46.48,5.33 46.48,3.04 47.52,2.06 JP53.1
N$65
  Top 0.254: USB.D+ 10.49,11.05 10.69,11.25 U2.2 11.65,11.85 12.12,12.32 14.97,12.32 R4.1
N$66
  Top 0.254: LED1.A JMP-LED.1
N$67
  Top 0.254: U1.42 39.03,18.85 33.23,18.85 33.05,18.67 31.78,18.67 | JP64.1 20.57,23.11 25.02,18.67 31.78,18.67 | 31.78,18.67 31.75,18.64 31.75,17.7 31.45,17.4 JMP-VBUS.2
N$68
  Bottom 0.254: R6.2 Q1.3
N$69
  cutout Top: 50.88,5.59 50.55,5.64 54.61,9.7 55.02,9.65 57.23,7.37 57.66,6.86 53.37,2.57 50.72,5.41 50.75,5.41 50.93,5.59
N$70
  Bottom 0.254: R2.1 46.91,23.44 JP48.1
N$71
  Bottom 0.254: R7.2 6.31,8.52 5.56,7.77 5.56,6.25 | 5.56,6.25 5.56,5.11 6.07,4.6 6.66,4.6 Q1.1 | R8.1 5.55,6.26 5.56,6.25
N$72
  Bottom 0.254: R8.2 4.43,4.46 5.33,3.56 JP5.1

### Text on the board
_tsilk: BT0 | BT1 | RESET | 1 | 0
_bsilk: STM32QFP64 STAMP V1.3.1